# EAGLE schematic charlieland4 (EAGLE 6.2)
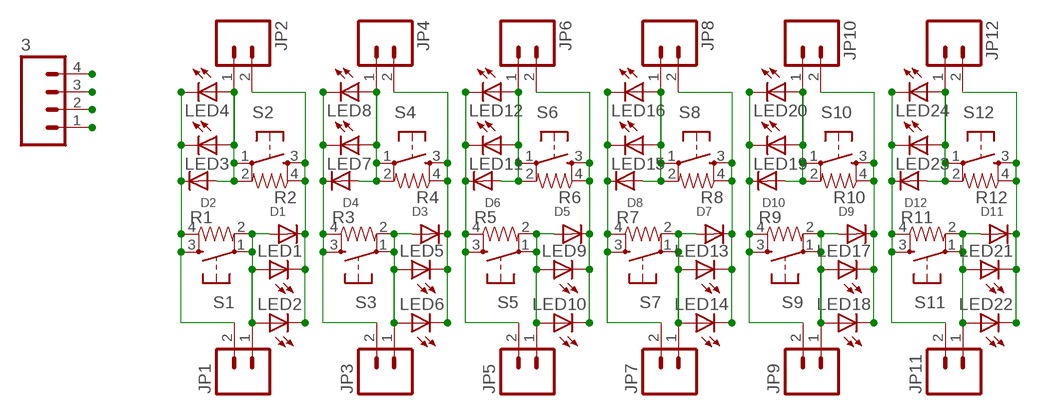
[diagram p0: schematic, sheet 1]

## Parts
3  M04PTH  [1X04]
D1  DIODEDO-1N4148  [DO-1N4148]
D2  DIODEDO-1N4148  [DO-1N4148]
D3  DIODEDO-1N4148  [DO-1N4148]
D4  DIODEDO-1N4148  [DO-1N4148]
D5  DIODEDO-1N4148  [DO-1N4148]
D6  DIODEDO-1N4148  [DO-1N4148]
D7  DIODEDO-1N4148  [DO-1N4148]
D8  DIODEDO-1N4148  [DO-1N4148]
D9  DIODEDO-1N4148  [DO-1N4148]
D10  DIODEDO-1N4148  [DO-1N4148]
D11  DIODEDO-1N4148  [DO-1N4148]
D12  DIODEDO-1N4148  [DO-1N4148]
JP1  M02PTH  [1X02]
JP2  M02PTH  [1X02]
JP3  M02PTH  [1X02]
JP4  M02PTH  [1X02]
JP5  M02PTH  [1X02]
JP6  M02PTH  [1X02]
JP7  M02PTH  [1X02]
JP8  M02PTH  [1X02]
JP9  M02PTH  [1X02]
JP10  M02PTH  [1X02]
JP11  M02PTH  [1X02]
JP12  M02PTH  [1X02]
LED1  LED5MM  [LED5MM]
LED2  LED3MM  [LED3MM]
LED3  LED5MM  [LED5MM]
LED4  LED3MM  [LED3MM]
LED5  LED5MM  [LED5MM]
LED6  LED3MM  [LED3MM]
LED7  LED5MM  [LED5MM]
LED8  LED3MM  [LED3MM]
LED9  LED5MM  [LED5MM]
LED10  LED3MM  [LED3MM]
LED11  LED5MM  [LED5MM]
LED12  LED3MM  [LED3MM]
LED13  LED5MM  [LED5MM]
LED14  LED3MM  [LED3MM]
LED15  LED5MM  [LED5MM]
LED16  LED3MM  [LED3MM]
LED17  LED5MM  [LED5MM]
LED18  LED3MM  [LED3MM]
LED19  LED5MM  [LED5MM]
LED20  LED3MM  [LED3MM]
LED21  LED5MM  [LED5MM]
LED22  LED3MM  [LED3MM]
LED23  LED5MM  [LED5MM]
LED24  LED3MM  [LED3MM]
R1  RESISTORPTH1  [AXIAL-0.3]
R2  RESISTORPTH1  [AXIAL-0.3]
R3  RESISTORPTH1  [AXIAL-0.3]
R4  RESISTORPTH1  [AXIAL-0.3]
R5  RESISTORPTH1  [AXIAL-0.3]
R6  RESISTORPTH1  [AXIAL-0.3]
R7  RESISTORPTH1  [AXIAL-0.3]
R8  RESISTORPTH1  [AXIAL-0.3]
R9  RESISTORPTH1  [AXIAL-0.3]
R10  RESISTORPTH1  [AXIAL-0.3]
R11  RESISTORPTH1  [AXIAL-0.3]
R12  RESISTORPTH1  [AXIAL-0.3]
S1  TAC_SWITCHPTH  [TACTILE-PTH]
S2  TAC_SWITCHPTH  [TACTILE-PTH]
S3  TAC_SWITCHPTH  [TACTILE-PTH]
S4  TAC_SWITCHPTH  [TACTILE-PTH]
S5  TAC_SWITCHPTH  [TACTILE-PTH]
S6  TAC_SWITCHPTH  [TACTILE-PTH]
S7  TAC_SWITCHPTH  [TACTILE-PTH]
S8  TAC_SWITCHPTH  [TACTILE-PTH]
S9  TAC_SWITCHPTH  [TACTILE-PTH]
S10  TAC_SWITCHPTH  [TACTILE-PTH]
S11  TAC_SWITCHPTH  [TACTILE-PTH]
S12  TAC_SWITCHPTH  [TACTILE-PTH]

## Nets
1: 3.1 D2.C D4.C D7.C JP1.2 JP3.2 JP8.2 LED3.K(C) LED4.K(C) LED7.K(C) LED8.K(C) LED13.K(C) LED14.K(C) R1.P$1 R3.P$1 R8.P$1 S1.3 S1.4 S3.3 S3.4 S8.3 S8.4
2: 3.2 D1.C D3.C D6.C D9.C JP2.2 JP4.2 JP5.2 JP10.2 LED1.K(C) LED2.K(C) LED5.K(C) LED6.K(C) LED11.K(C) LED12.K(C) LED17.K(C) LED18.K(C) R2.P$1 R4.P$1 R5.P$1 R10.P$1 S2.3 S2.4 S4.3 S4.4 S5.3 S5.4 S10.3 S10.4
3: 3.3 D5.C D11.C JP6.2 JP12.2 LED9.K(C) LED10.K(C) LED21.K(C) LED22.K(C) R6.P$1 R12.P$1 S6.3 S6.4 S12.3 S12.4
4: 3.4 D8.C D10.C D12.C JP7.2 JP9.2 JP11.2 LED15.K(C) LED16.K(C) LED19.K(C) LED20.K(C) LED23.K(C) LED24.K(C) R7.P$1 R9.P$1 R11.P$1 S7.3 S7.4 S9.3 S9.4 S11.3 S11.4
N$1: D3.A JP3.1 LED5.A LED6.A R3.P$2 S3.1 S3.2
N$2: D4.A JP4.1 LED7.A LED8.A R4.P$2 S4.1 S4.2
N$3: D1.A JP1.1 LED1.A LED2.A R1.P$2 S1.1 S1.2
N$4: D2.A JP2.1 LED3.A LED4.A R2.P$2 S2.1 S2.2
N$5: D5.A JP5.1 LED9.A LED10.A R5.P$2 S5.1 S5.2
N$6: D6.A JP6.1 LED11.A LED12.A R6.P$2 S6.1 S6.2
N$7: D7.A JP7.1 LED13.A LED14.A R7.P$2 S7.1 S7.2
N$8: D8.A JP8.1 LED15.A LED16.A R8.P$2 S8.1 S8.2
N$9: D9.A JP9.1 LED17.A LED18.A R9.P$2 S9.1 S9.2
N$10: D10.A JP10.1 LED19.A LED20.A R10.P$2 S10.1 S10.2
N$11: D11.A JP11.1 LED21.A LED22.A R11.P$2 S11.1 S11.2
N$12: D12.A JP12.1 LED23.A LED24.A R12.P$2 S12.1 S12.2

## Library data of the parts
3 = SparkFun:M04: Header 4 Standard 4-pin 0.1" header. Use with straight break away headers (SKU : PRT-00116), right angle break away headers (PRT-00553), swiss pins (PRT-00743), machine pins (PRT-00117), and female headers (PRT-00115). Molex polarized connector foot print use with SKU : PRT-08231 with associated crimp pins and housings.
D1-D12 = adafruit:DIODE: Diode SMADIODE - SMA Surface Mount Package 20V 1A Schottky Diode Digikey: 641-1014-6-ND DO-1N4148 - Through Hole Small Current Diode SOD-123 20V 1 A (.5mV Vf) Schottky Diode - Digikey: MBRX120TPMSCT-ND SOD-323 10V 570mA (.38mV Vf, 3ns) Schottky Diode - Digikey: ZLLS410CT-ND SOD-523 30V 30mA Schottky Diode (RB751S-40TE61) - Digikey: RB751S-40TE61CT-ND SOT23-R/W - SOT23 Package (R = Solder Paste/Reflow Ovens, W = Hand-Soldering) BAT54Film 40V 300mA - Digikey: 497-7162-1-ND
JP1-JP12 = SparkFun:M02: Header 2 Standard 2-pin 0.1" header. Use with straight break away headers (SKU : PRT-00116), right angle break away headers (PRT-00553), swiss pins (PRT-00743), machine pins (PRT-00117), and female headers (PRT-00115). Molex polarized connector foot print use with SKU : PRT-08233 with associated crimp pins and housings.
LED1-LED24 = adafruit:LED: LED OSRAM: - CHIPLED LG R971, LG N971, LY N971, LG Q971, LY Q971, LO R971, LY R971 LH N974, LH R974 LS Q976, LO Q976, LY Q976 LO Q996 - Hyper CHIPLED LW Q18S LB Q993, LB Q99A, LB R99A - SideLED LS A670, LO A670, LY A670, LG A670, LP A670 LB A673, LV A673, LT A673, LW A673 LH A674 LY A675 LS A676, LA A676, LO A676, LY A676, LW A676 LS A679, LY A679, LG A679 - Hyper Micro SIDELED® LS Y876, LA Y876, LO Y876, LY Y876 LT Y87S - SmartLED LW L88C, LW L88S LB L89C, LB L89S, LG L890 LS L89K, LO L89K, LY L89K LS L896, LA L896, LO L896, LY L896 - TOPLED LS T670, LO T670, LY T670, LG T670, LP T670 LSG T670, LSP T670, LSY T670, LOP T670, LYG T670 LG T671, LOG T671, LSG T671 LB T673, LV T673, LT T673, LW T673 LH T674 LS T676, LA T676, LO T676, LY T676, LB T676, LH T676, LSB T676, LW T676 LB T67C, LV T67C, LT T67C, LS T67K, LO T67K, LY T67K, LW E67C LS E67B, LA E67B, LO E67B, LY E67B, LB E67C, LV E67C, LT E67C LW T67C LS T679, LY T679, LG T679 LS T770, LO T770, LY T770, LG T770, LP T770 LB T773, LV T773, LT T773, LW T773 LH T774 LS E675, LA E675, LY E675, LS T675 LS T776, LA T776, LO T776, LY T776, LB T776 LHGB T686 LT T68C, LB T68C - Hyper Mini TOPLED® LB M676 - Mini TOPLED Santana® LG M470 LS M47K, LO M47K, LY M47K Source: http://www.osram.convergy.de/
R1-R12 = SparkFun:RESISTOR: Resistor Basic schematic elements and footprints for 0603, 1206, and PTH 1/10th watt (small) resistors.
S1-S12 = SparkFun:TAC_SWITCH: Momentary Switch Button commonly used for reset or general input. Spark Fun Electronics SKU : COM-00097